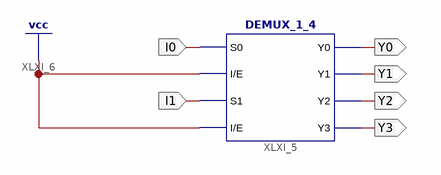
[diagram p0: schematic sheet 1]
// Xilinx ISE schematic Decoder_with_demux.sch (artix7) as structural Verilog: 1 symbols, 6 ports
module Decoder_with_demux (
  input  I0,
  input  I1,
  output Y0,
  output Y1,
  output Y2,
  output Y3
);

  DEMUX_1_4 XLXI_5 (.S0(I0), .I(1'b1), .S1(I1), .E(1'b1), .Y0(Y0), .Y1(Y1), .Y2(Y2), .Y3(Y3));
endmodule
